# Altium schematic sheet ShineRider.SchDoc
size A3; SheetNumber: 1; SheetTotal: 1
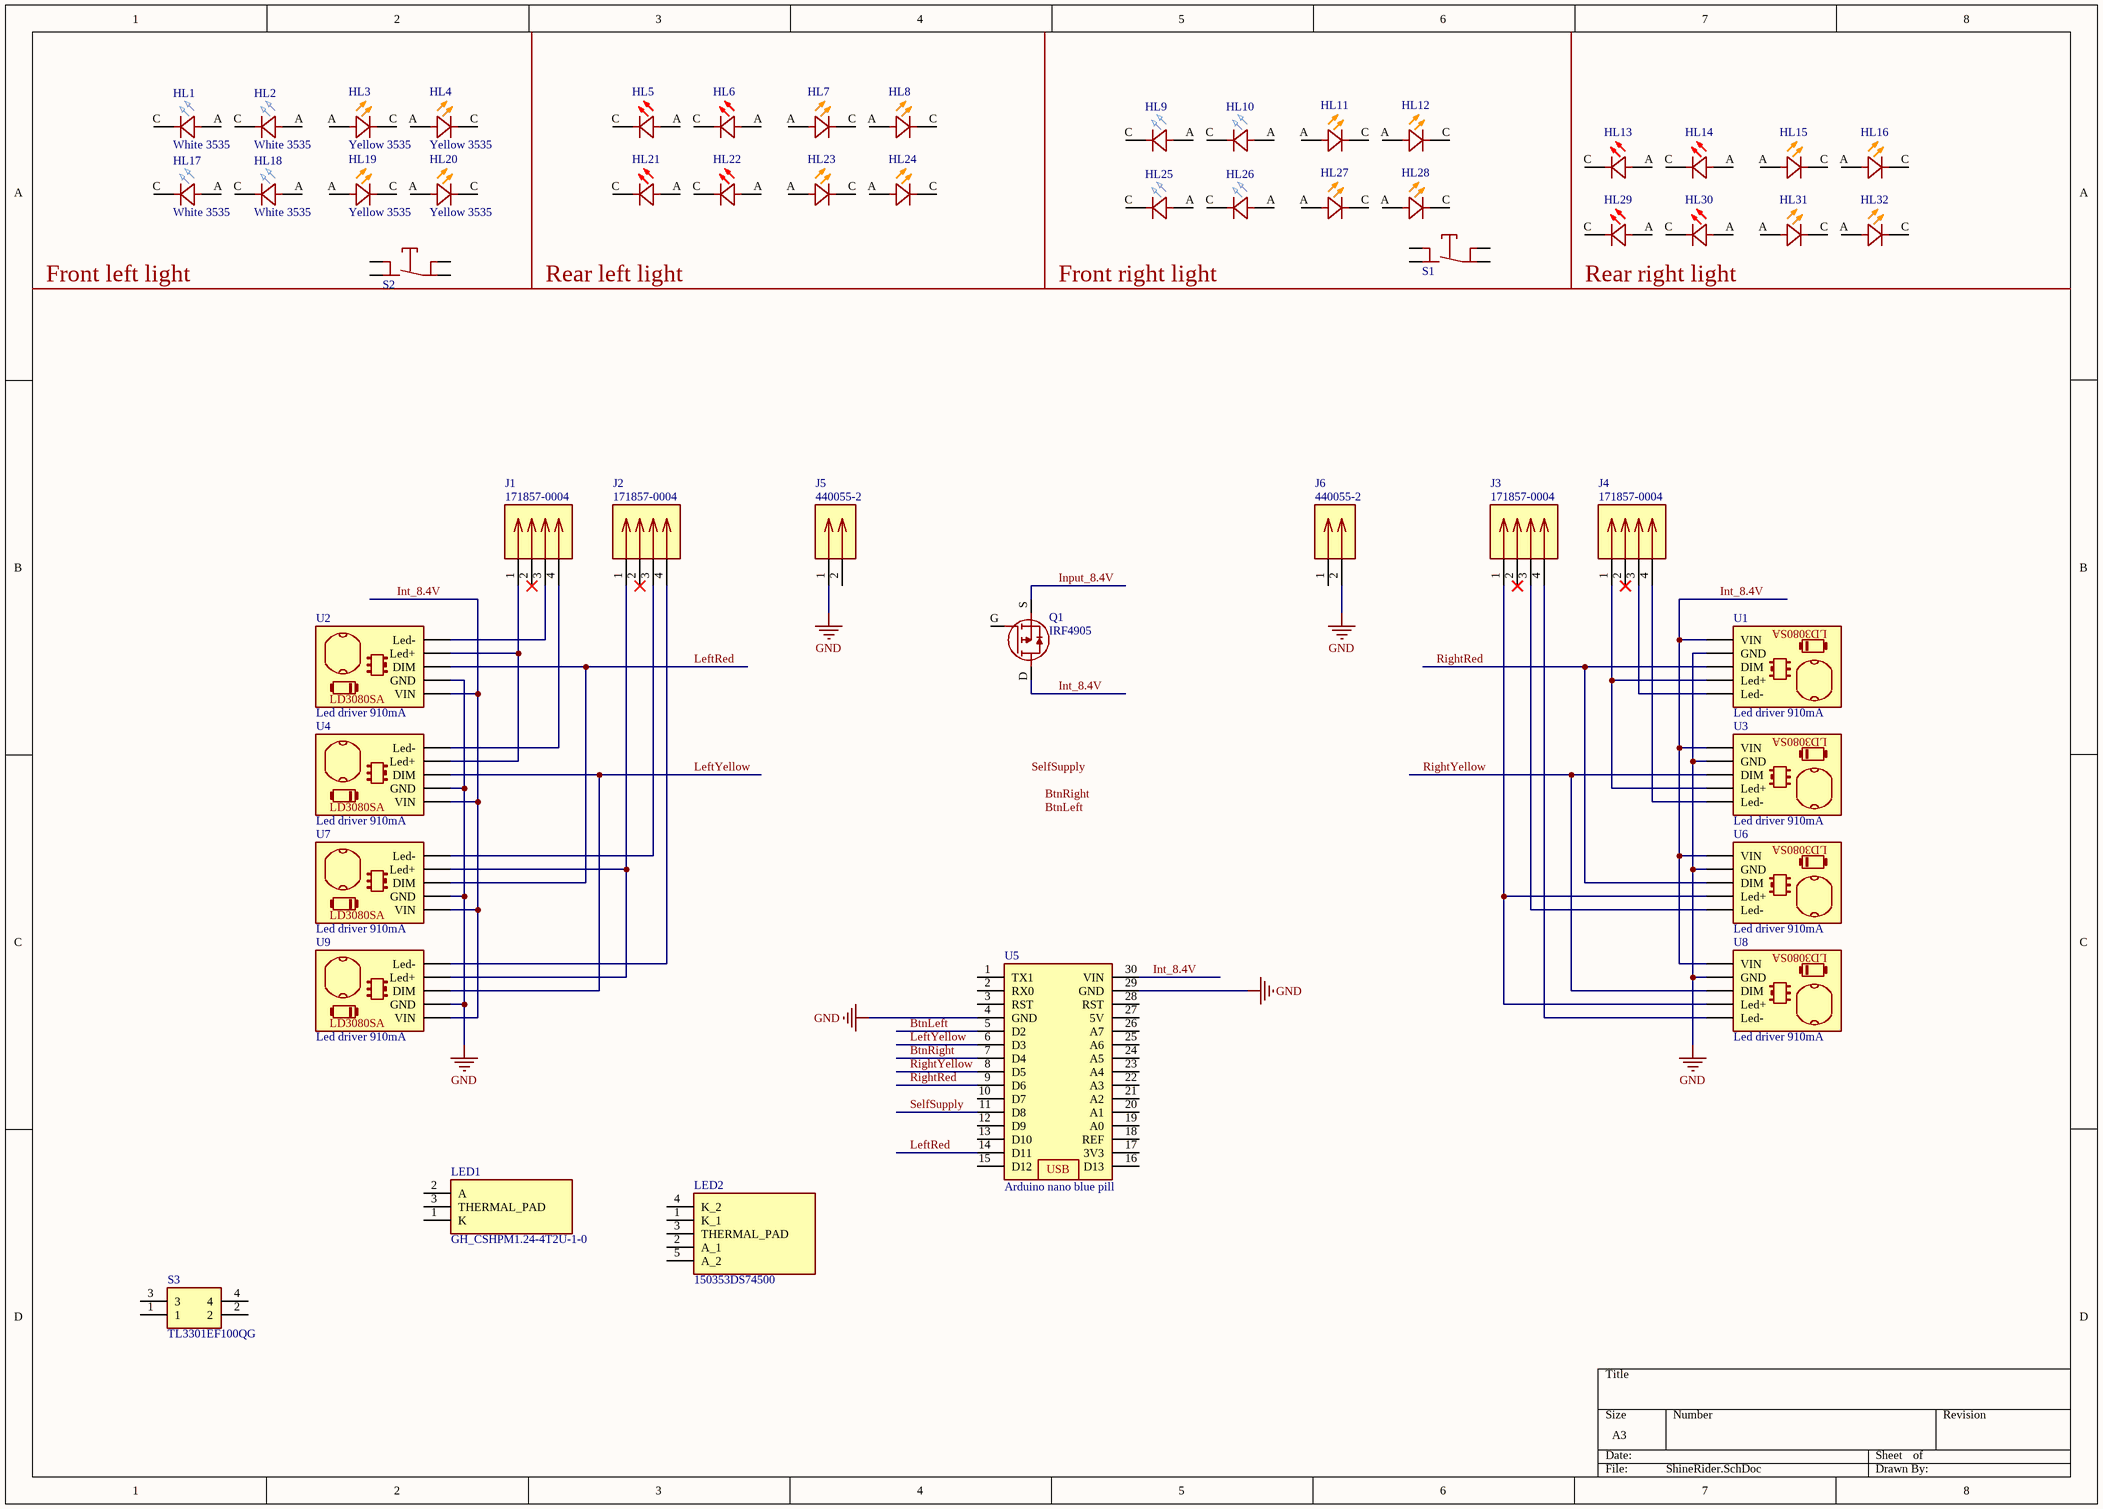
[diagram p0: ShineRider.SchDoc]

## Parts
HL1  White 3535  [150353FS74500]
HL2  White 3535  [150353FS74500]
HL3  Yellow 3535  [150353FS74500]
HL4  Yellow 3535  [150353FS74500]
HL5  Red 3535  [150353FS74500]  (value not drawn)
HL6  Red 3535  [150353FS74500]  (value not drawn)
HL7  Yellow 3535  [150353FS74500]  (value not drawn)
HL8  Yellow 3535  [150353FS74500]  (value not drawn)
HL9  White 3535  [150353FS74500]  (value not drawn)
HL10  White 3535  [150353FS74500]  (value not drawn)
HL11  Yellow 3535  [150353FS74500]  (value not drawn)
HL12  Yellow 3535  [150353FS74500]  (value not drawn)
HL13  Red 3535  [150353FS74500]  (value not drawn)
HL14  Red 3535  [150353FS74500]  (value not drawn)
HL15  Yellow 3535  [150353FS74500]  (value not drawn)
HL16  Yellow 3535  [150353FS74500]  (value not drawn)
HL17  White 3535  [150353FS74500]
HL18  White 3535  [150353FS74500]
HL19  Yellow 3535  [150353FS74500]
HL20  Yellow 3535  [150353FS74500]
HL21  Red 3535  [150353FS74500]  (value not drawn)
HL22  Red 3535  [150353FS74500]  (value not drawn)
HL23  Yellow 3535  [150353FS74500]  (value not drawn)
HL24  Yellow 3535  [150353FS74500]  (value not drawn)
HL25  White 3535  [150353FS74500]  (value not drawn)
HL26  White 3535  [150353FS74500]  (value not drawn)
HL27  Yellow 3535  [150353FS74500]  (value not drawn)
HL28  Yellow 3535  [150353FS74500]  (value not drawn)
HL29  Red 3535  [150353FS74500]  (value not drawn)
HL30  Red 3535  [150353FS74500]  (value not drawn)
HL31  Yellow 3535  [150353FS74500]  (value not drawn)
HL32  Yellow 3535  [150353FS74500]  (value not drawn)
J1  171857-0004  [171857-0004]
J2  171857-0004  [171857-0004]
J3  171857-0004  [171857-0004]
J4  171857-0004  [171857-0004]
J5  440055-2  [SHDRRA2W50P0X200_1X2_600X770X525P]
J6  440055-2  [SHDRRA2W50P0X200_1X2_600X770X525P]
LED1  GH_CSHPM1.24-4T2U-1-0  [GHCSHPM1244T2U10]
LED2  150353DS74500  [150353DS74500]
Q1  IRF4905  [IRF4905STRLPBF]
S1  BTN  [TL3301EF100QG]  (value not drawn)
S2  BTN  [TL3301EF100QG]  (value not drawn)
S3  TL3301EF100QG  [TL3301EF100QG]
U1  Led driver 910mA  [LD3080SA]
U2  Led driver 910mA  [LD3080SA]
U3  Led driver 910mA  [LD3080SA]
U4  Led driver 910mA  [LD3080SA]
U5  Arduino nano blue pill  [ArduinoNanoBluePill]
U6  Led driver 910mA  [LD3080SA]
U7  Led driver 910mA  [LD3080SA]
U8  Led driver 910mA  [LD3080SA]
U9  Led driver 910mA  [LD3080SA]

## Nets
GND: J5.1 J6.2 U1.2(GND) U2.2(GND) U3.2(GND) U4.2(GND) U5.4(GND) U5.29(GND) U6.2(GND) U7.2(GND) U8.2(GND) U9.2(GND)
BtnLeft: U5.5(D2)
BtnRight: U5.7(D4)
Input_8.4V: Q1.S
Int_8.4V: Q1.D U1.1(VIN) U2.1(VIN) U3.1(VIN) U4.1(VIN) U5.30(VIN) U6.1(VIN) U7.1(VIN) U8.1(VIN) U9.1(VIN)
LeftRed: U2.3(DIM) U5.14(D11) U7.3(DIM)
LeftYellow: U4.3(DIM) U5.6(D3) U9.3(DIM)
RightRed: U1.3(DIM) U5.9(D6) U6.3(DIM)
RightYellow: U3.3(DIM) U5.8(D5) U8.3(DIM)
SelfSupply: U5.11(D8)
NetJ1_1: J1.1 U2.4(Led+) U4.4(Led+)
NetJ1_3: J1.3 U2.5(Led-)
NetJ1_4: J1.4 U4.5(Led-)
NetJ2_1: J2.1 U7.4(Led+) U9.4(Led+)
NetJ2_3: J2.3 U7.5(Led-)
NetJ2_4: J2.4 U9.5(Led-)
NetJ3_1: J3.1 U6.4(Led+) U8.4(Led+)
NetJ3_3: J3.3 U6.5(Led-)
NetJ3_4: J3.4 U8.5(Led-)
NetJ4_1: J4.1 U1.4(Led+) U3.4(Led+)
NetJ4_3: J4.3 U1.5(Led-)
NetJ4_4: J4.4 U3.5(Led-)

Not connected (* = marked no-connect by the designer): HL1 A C(CK); HL2 A C(CK); HL3 A C(CK); HL4 A C(CK); HL5 A C(CK); HL6 A C(CK); HL7 A C(CK); HL8 A C(CK); HL9 A C(CK); HL10 A C(CK); HL11 A C(CK); HL12 A C(CK); HL13 A C(CK); HL14 A C(CK); HL15 A C(CK); HL16 A C(CK); HL17 A C(CK); HL18 A C(CK); HL19 A C(CK); HL20 A C(CK); HL21 A C(CK); HL22 A C(CK); HL23 A C(CK); HL24 A C(CK); HL25 A C(CK); HL26 A C(CK); HL27 A C(CK); HL28 A C(CK); HL29 A C(CK); HL30 A C(CK); HL31 A C(CK); HL32 A C(CK); J1 2*; J2 2*; J3 2*; J4 2*; J5 2; J6 1; LED1 1(K) 2(A) 3(THERMAL_PAD); LED2 1(K_1) 2(A_1) 3(THERMAL_PAD) 4(K_2) 5(A_2); Q1 G; S1 1 2 3 4; S2 1 2 3 4; S3 1 2 3 4; U5 1(TX1) 2(RX0) 3(RST) 10(D7) 12(D9) 13(D10) 15(D12) 16(D13) 17(3V3) 18(REF) 19(A0) 20(A1) 21(A2) 22(A3) 23(A4) 24(A5) 25(A6) 26(A7) 27(5V) 28(RST)

## Notes on the sheet
- Front left light
- Rear left light
- Front right light
- Rear right light
- Labels drawn without touching a wire or pin: BtnLeft, BtnRight, SelfSupply
- (in symbol ArduinoNano) USB

## Library data of the parts
HL1 HL2 HL9 HL10 HL17 HL18 HL25 HL26 = 3535 white led
HL3 HL4 HL7 HL8 HL11 HL12 HL15 HL16 HL19 HL20 HL23 HL24 HL27 HL28 HL31 HL32 = 3535 yellow led
HL5 HL6 HL13 HL14 HL21 HL22 HL29 HL30 = 3535 red led
J1-J4 = 171857-0004: KK 254 RPC Pin Header right angle 4way Molex KK 254 Series, Series Number 171857, 2.54mm Pitch 4 Way 1 Row Right Angle PCB Header, Through Hole; Geometry.Height: 6.35mm; Mouser Part Number: 538-171857-0004; Mouser Price/Stock: https://www.mouser.co.uk/ProductDetail/Molex/171857-0004?qs=vOeJqewp7jCR1L%252BJpRVw7w%3D%3D; Manufacturer_Name: Molex; Manufacturer_Part_Number: 171857-0004; Datasheet Link: http://www.molex.com/webdocs/datasheets/pdf/en-us//1718570004_PCB_HEADERS.pdf
J5 J6 = 440055-2: Body Features: Primary Product Color Natural; Manufacturer_Name: TE Connectivity; Geometry.Height: 5.25mm; Mouser Part Number: 571-440055-2; Mouser Price/Stock: https://www.mouser.co.uk/ProductDetail/TE-Connectivity/440055-2?qs=DE9Qji9blsSmCkgS7fKI6w%3D%3D; Manufacturer_Part_Number: 440055-2; Datasheet Link: https://www.te.com/commerce/DocumentDelivery/DDEController?Action=srchrtrv&DocNm=1-1773713-2_HPI_QRG_EN&DocType=Data%20Sheet&DocLang=English&PartCntxt=440055-2&DocFormat=pdf
LED1 = GH_CSHPM1.24-4T2U-1-0: LED; Manufacturer_Name: ams OSRAM; Manufacturer_Part_Number: GH CSHPM1.24-4T2U-1-0; Datasheet Link: https://www.arrow.com/en/products/gh-cshpm1.24-4t2u-1-0/osram-opto-semiconductors; Height: 1.51mm; Mouser Part Number: 720-GHCSHPM124A9329; Mouser Price/Stock: https://www.mouser.com/Search/Refine.aspx?Keyword=720-GHCSHPM124A9329; Arrow Part Number: GH CSHPM1.24-4T2U-1-0; Arrow Price/Stock: https://www.arrow.com/en/products/gh-cshpm1.24-4t2u-1-0/osram-opto-semiconductors
LED2 = 150353DS74500: LED; Manufacturer_Name: Wurth Elektronik; Datasheet Link: https://katalog.we-online.de/led/datasheet/150353DS74500.pdf; Height: 2.25mm; Manufacturer_Part_Number: 150353DS74500; Mouser Part Number: 710-150353DS74500; Mouser Price/Stock: https://www.mouser.co.uk/ProductDetail/Wurth-Elektronik/150353DS74500?qs=8Aam6%252B7C6HFXWLTTBFj7xQ%3D%3D
Q1 = IRF4905STRLPBF: P-channel MOSFET with a maximum continuous drain current of 74 A, maximum operating voltage of 55 V, and maximum power dissipation of 170 W.; Manufacturer_Name: Infineon; Geometry.Height: 4.83mm; Mouser Part Number: 942-IRF4905STRLPBF; Mouser Price/Stock: https://www.mouser.co.uk/ProductDetail/Infineon-Technologies/IRF4905STRLPBF?qs=9%252BKlkBgLFf1nPwXuyqKOOQ%3D%3D; Manufacturer_Part_Number: IRF4905STRLPBF; Datasheet Link: https://www.infineon.com/dgdl/irf4905spbf.pdf?fileId=5546d462533600a4015355e331c41980
S1 S2 = TL3301EF100QG: SWITCH TACTILE SPST-NO 0.05A; Manufacturer_Name: E-Switch; Datasheet Link: https://configured-product-images.s3.amazonaws.com/2D/specs/TL3301EF100QG.pdf; Height: 7.4mm; Manufacturer_Part_Number: TL3301EF100QG; Mouser Part Number: 612-TL3301EF; Mouser Price/Stock: https://www.mouser.co.uk/ProductDetail/E-Switch/TL3301EF100QG?qs=iWbXB9lueyBOmcew73zYTQ%3D%3D
S3 = TL3301EF100QG: Switch; Manufacturer_Name: E-Switch; Datasheet Link: https://configured-product-images.s3.amazonaws.com/2D/specs/TL3301EF100QG.pdf; Height: 7.4mm; Manufacturer_Part_Number: TL3301EF100QG; Mouser Part Number: 612-TL3301EF; Mouser Price/Stock: https://www.mouser.co.uk/ProductDetail/E-Switch/TL3301EF100QG?qs=iWbXB9lueyBOmcew73zYTQ%3D%3D
U1-U4 U6-U9 = LD3080SA
U5 = ArduinoNano